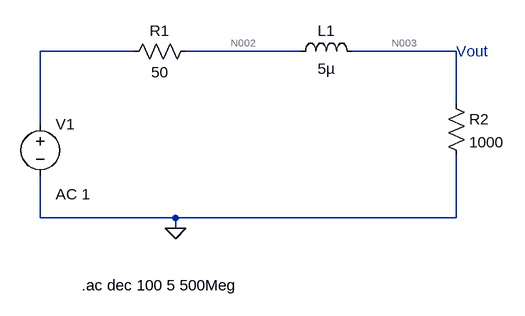
[diagram p0: schematic Series_Inductor_filter.asc]
Series_Inductor_filter.asc, the LTspice schematic file:
Version 4
SHEET 1 1016 1572
WIRE -16 -112 -160 -112
WIRE 240 -112 64 -112
WIRE 480 -112 320 -112
WIRE 480 -32 480 -112
WIRE -160 0 -160 -112
WIRE -160 144 -160 80
WIRE 48 144 -160 144
WIRE 480 144 480 48
WIRE 480 144 48 144
WIRE 48 160 48 144
FLAG 48 160 0
SYMBOL ind 224 -96 R270
WINDOW 0 32 56 VTop 2
WINDOW 3 5 56 VBottom 2
SYMATTR InstName L1
SYMATTR Value 5µ
SYMBOL res 80 -128 R90
WINDOW 0 0 56 VBottom 2
WINDOW 3 32 56 VTop 2
SYMATTR InstName R1
SYMATTR Value 50
SYMBOL res 464 -48 R0
SYMATTR InstName R2
SYMATTR Value 1000
SYMBOL voltage -160 -16 R0
WINDOW 123 24 124 Left 2
WINDOW 39 0 0 Left 0
SYMATTR InstName V1
SYMATTR Value ""
SYMATTR Value2 AC 1
TEXT 480 -112 Left 2 ;Vout
TEXT -96 248 Left 2 !.ac dec 100 5 500Meg

The netlist it stands for:
* Series_Inductor_filter.asc
L1 N002 N003 5µ
R1 N002 N001 50
R2 N003 0 1000
V1 N001 0 AC 1
* Vout
.ac dec 100 5 500Meg
.backanno
.end

* Results of the author's LTspice run, read from the files saved beside the schematic
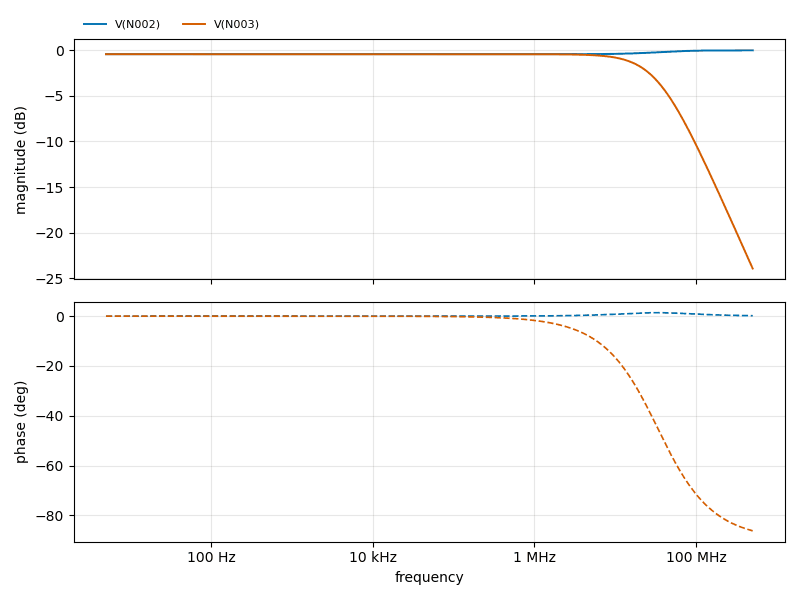
[diagram p1: AC Analysis of Series_Inductor_filter.asc, plotted from the saved traces]
* AC Analysis, 1 run:
*   V(N002): -0.42 dB at 5 Hz, -0.00 dB at 500 MHz, peak -0.00 dB at 500 MHz
*   V(N003): -0.42 dB at 5 Hz, -23.94 dB at 500 MHz, peak -0.42 dB at 5.358 Hz, 3 dB below the peak at 33.42 MHz